# Altium schematic sheet wisp-6-afe.SchDoc: AFE
size B; SheetNumber: 3; SheetTotal: 4
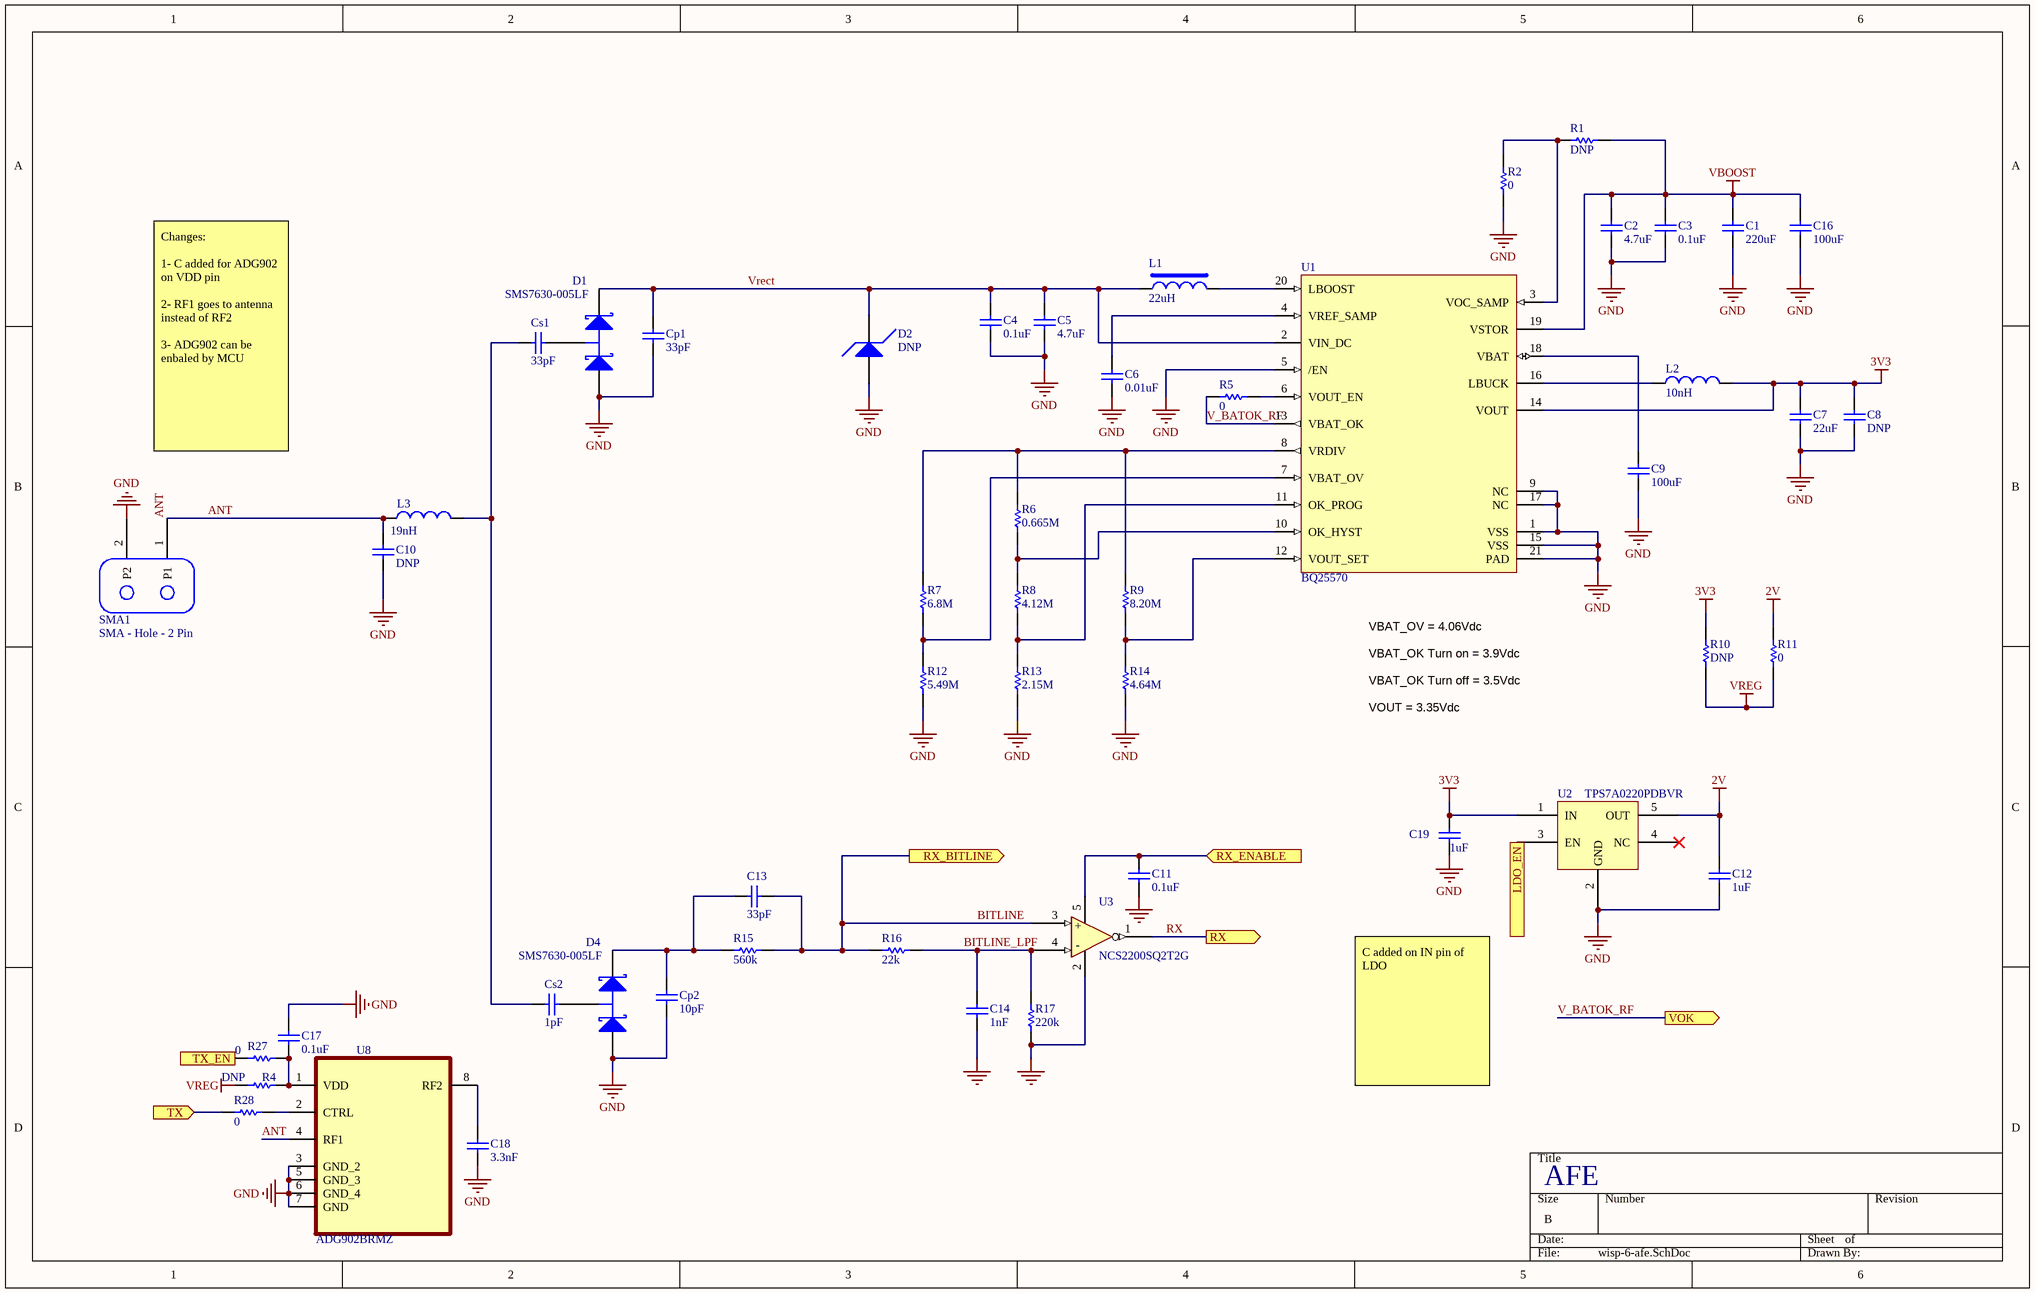
[diagram p0: wisp-6-afe.SchDoc]

## Parts
C1  value 220uF  [1206]  (hidden comment: Cap)
C2  value 4.7uF  [0402]  (hidden comment: Cap)
C3  value 0.1uF  [0402]  (hidden comment: Cap)
C4  value 0.1uF  [0402]  (hidden comment: Cap)
C5  value 4.7uF  [0402]  (hidden comment: Cap)
C6  value 0.01uF  [0402]  (hidden comment: Cap)
C7  value 22uF  [0402]  (hidden comment: Cout1)
C8  value DNP  [0402]  (hidden comment: Cout2)
C9  value 100uF  [0805]  (hidden comment: Cap)
C10  value DNP  [0402]  (hidden comment: Cap)
C11  value 0.1uF  [0402]  (hidden comment: Cap)
C12  value 1uF  [0402]  (hidden comment: Cap)
C13  value 33pF  [0402]  (hidden comment: Cap)
C14  value 1nF  [0402]  (hidden comment: Cap)
C16  value 100uF  [0805]  (hidden comment: Cap)
C17  value 0.1uF  [0402]  (hidden comment: Cap)
C18  value 3.3nF  [0402]  (hidden comment: Cap)
C19  value 1uF  [0402]  (hidden comment: Cap)
Cp1  value 33pF  [0402]  (hidden comment: Cap)
Cp2  value 10pF  [0402]  (hidden comment: Cap)
Cs1  value 33pF  [0402]  (hidden comment: Cap)
Cs2  value 1pF  [0402]  (hidden comment: Cap)
D1  SMS7630-005LF  [SOT23 - N]
D2  DNP  [Zener_SOD-523]
D4  SMS7630-005LF  [SOT23 - N]
L1  value 22uH  [LPS4018]  (hidden comment: Ind_LPS4018)
L2  value 10nH  [IND1008]  (hidden comment: Ind)
L3  value 19nH  [0603]  (hidden comment: Ind)
R1  value DNP  [0402]  (hidden comment: R_80%)
R2  value 0  [0402]  (hidden comment: R_50%)
R4  value DNP  [0402]  (hidden comment: Rok3)
R5  value 0  [0402]  (hidden comment: R_VBAT_OK)
R6  value 0.665M  [0402]  (hidden comment: Rok3)
R7  value 6.8M  [0402]  (hidden comment: Rov2)
R8  value 4.12M  [0402]  (hidden comment: Rok2)
R9  value 8.20M  [0402]  (hidden comment: 8.2M)
R10  value DNP  [0402]  (hidden comment: Res)
R11  value 0  [0402]  (hidden comment: Res)
R12  value 5.49M  [0402]  (hidden comment: Rov1)
R13  value 2.15M  [0402]  (hidden comment: Rok1)
R14  4.64M  [0402]
R15  value 560k  [0402]  (hidden comment: Res)
R16  value 22k  [0402]  (hidden comment: Res)
R17  value 220k  [0402]  (hidden comment: Res)
R27  value 0  [0402]  (hidden comment: Rok3)
R28  value 0  [0402]  (hidden comment: Rok3)
SMA1  SMA - Hole - 2 Pin  [SMA - Hole - 2 Pin]
U1  BQ25570  [BQ25570]
U2  TPS7A0220PDBVR  [SOT23-5]
U3  NCS2200SQ2T2G  [SC70-5]
U8  ADG902BRMZ  [SOP65P490X110-8N]

## Ports
LDO_EN (in), RX (out), RX_BITLINE (out), RX_ENABLE (in), TX (in), TX_EN (in), VOK (out)

## Nets
2V: C12.2 R11.1 U2.5(OUT)
3V3: C7.2 C8.2 C19.2 L2.2 R10.1 U1.14(VOUT) U2.1(IN)
GND: C1.1 C2.1 C3.1 C4.1 C5.1 C6.1 C7.1 C8.1 C9.1 C10.1 C11.2 C12.1 C14.2 C16.1 C17.1 C18.1 C19.1 Cp1.2 Cp2.2 D1.1(A) D2.1(A) D4.1(A) R2.1 R12.2 R13.2 R14.2 R17.2 SMA1.2(P2) U1.1(VSS) U1.5(/EN) U1.9(NC) U1.15(VSS) U1.17(NC) U1.21(PAD) U2.2(GND) U3.2(Gnd) U8.3(GND_2) U8.5(GND_3) U8.6(GND_4) U8.7(GND)
VBOOST: C1.2 C2.2 C3.2 C16.2 R1.2 U1.19(VSTOR)
VREG: R4.2 R10.2 R11.2
ANT: C10.2 L3.1 SMA1.1(P1) U8.4(RF1)
BITLINE: C13.2 R15.1 R16.2 U3.3(IN+) ; port RX_BITLINE
BITLINE_LPF: C14.1 R16.1 R17.1 U3.4(In-)
LDO_EN: U2.3(EN) ; port LDO_EN
RX: U3.1(OUT) ; port RX
RX_ENABLE: C11.1 U3.5(VDD) ; port RX_ENABLE
TX: R28.2 ; port TX
TX_EN: R27.2 ; port TX_EN
V_BATOK_RF: R5.1 U1.13(VBAT_OK) ; port VOK
Vrect: C4.2 C5.2 Cp1.1 D1.2(K) D2.2(K) L1.1 U1.2(VIN_DC)
NetC6_2: C6.2 U1.4(VREF_SAMP)
NetC9_2: C9.2 U1.18(VBAT)
NetC13_1: C13.1 Cp2.1 D4.2(K) R15.2
NetC17_2: C17.2 R4.1 R27.1 U8.1(VDD)
NetC18_2: C18.2 U8.8(RF2)
NetCs1_1: Cs1.1 Cs2.1 L3.2
NetCs1_2: Cs1.2 D1.3(C)
NetCs2_2: Cs2.2 D4.3(C)
NetL1_2: L1.2 U1.20(LBOOST)
NetL2_1: L2.1 U1.16(LBUCK)
NetR1_1: R1.1 R2.2 U1.3(VOC_SAMP)
NetR5_2: R5.2 U1.6(VOUT_EN)
NetR6_1: R6.1 R7.1 R9.1 U1.8(VRDIV)
NetR6_2: R6.2 R8.1 U1.10(OK_HYST)
NetR7_2: R7.2 R12.1 U1.7(VBAT_OV)
NetR8_2: R8.2 R13.1 U1.11(OK_PROG)
NetR9_2: R9.2 R14.1 U1.12(VOUT_SET)
NetR28_1: R28.1 U8.2(CTRL)

Not connected (* = marked no-connect by the designer): U2 4(NC)*

## Notes on the sheet
- Changes:
  1- C added for ADG902 on VDD pin
  2- RF1 goes to antenna instead of RF2
  3- ADG902 can be enbaled by MCU
- VBAT_OV = 4.06Vdc
- VBAT_OK Turn on = 3.9Vdc
- VBAT_OK Turn off = 3.5Vdc
- VOUT = 3.35Vdc
- C added on IN pin of LDO
- (in symbol NCS2200) +; -

## Library data of the parts
C1-C14 C16-C19 Cp1 Cp2 Cs1 Cs2 = Cap: Ceramic Capacitor (Surface Mount); Manufacturer: Generic Ceramic Chip Cap (TBD); Digi-Key Part Number: *; Manufacturer Part Number: *; Note: *; Rating: *
  C7 C8: Comment_1: Cap
D1 D4 = SMS7630-005LF: Schottky Diodes & Rectifiers Ls=1.5nH SOT-23 Series Pair
D2 = Zener_SOD-523: Diode - Zener; Manufacturer Part Number: *; Manufacturer: *; Digi-Key Part Number: *; Note: *
L1 = Ind_LPS4018: Inductor (Surface Mount); Manufacturer: Coil Craft; Digi-Key Part Number: *; Manufacturer Part Number: *; Rating: *; Note: *
L2 L3 = Ind: Inductor (Surface Mount); Digi-Key Part Number: *; Manufacturer: *; Manufacturer Part Number: *; Rating: *; Note: *
R1 R2 R4-R17 R27 R28 = Res: Chip Resistor (Surface Mount); Manufacturer: Generic Chip Res (TBD); Manufacturer Part Number: *; Digi-Key Part Number: *; Rating: *
  R1 R2 R4-R9 R12 R13 R27 R28: Comment_1: Res
  R14: Value: 4.64M; Comment_1: Res
  R15-R17: Note: *
SMA1 = SMA - Hole - 2 Pin: Two pin SMA connector wisp; Note: This part is used to attach the antennae to WISP in the layout
U1 = BQ25570: Boost Charger; Manufacturer: Texas Instruments; Digi-Key Part Number: 296-37014-1-ND; Manufacturer Part Number: bq25570; Rating: *; Value: *; Note: *
U2 = TPS7A0218PDBVR: IC REG LINEAR 2V 200MA SOT23-5
U3 = NCS2200: Comparator General Purpose Open Drain SC-70-5; Manufacturer: ON Semiconductor; Digi-Key Part Number: NCS2200SQ2T2GOSTR-ND; Manufacturer Part Number: NCS2200SQ2T2G; Rating: *; Value: *; Note: *
U8 = ADG902BRMZ: RF Switch IC General Purpose SPST 2.5GHz 50Ohm 8-MSOP; MF: Analog Devices; Digi-Key_Part_Number: ADG902BRMZ-ND; MP: ADG902BRMZ; Purchase-URL: https://pricing.snapeda.com/search/part/ADG902BRMZ/?ref=eda; Value: *; SnapEDA_Link: https://www.snapeda.com/parts/ADG902BRMZ/Analog%20Devices%20Inc./view-part/233734/?ref=snap; Check_prices: https://www.snapeda.com/parts/ADG902BRMZ/Analog%20Devices%20Inc./view-part/233734/?ref=eda; Package: MSOP-8 Analog Devices